# EasyEDA schematic Personal Project 2020-21.json
TITLE: Sheet_1; REV: 1.0; Date: 2021-01-09; Sheet: 1/1; Drawn By: NicolasRyj; Company: Your Company
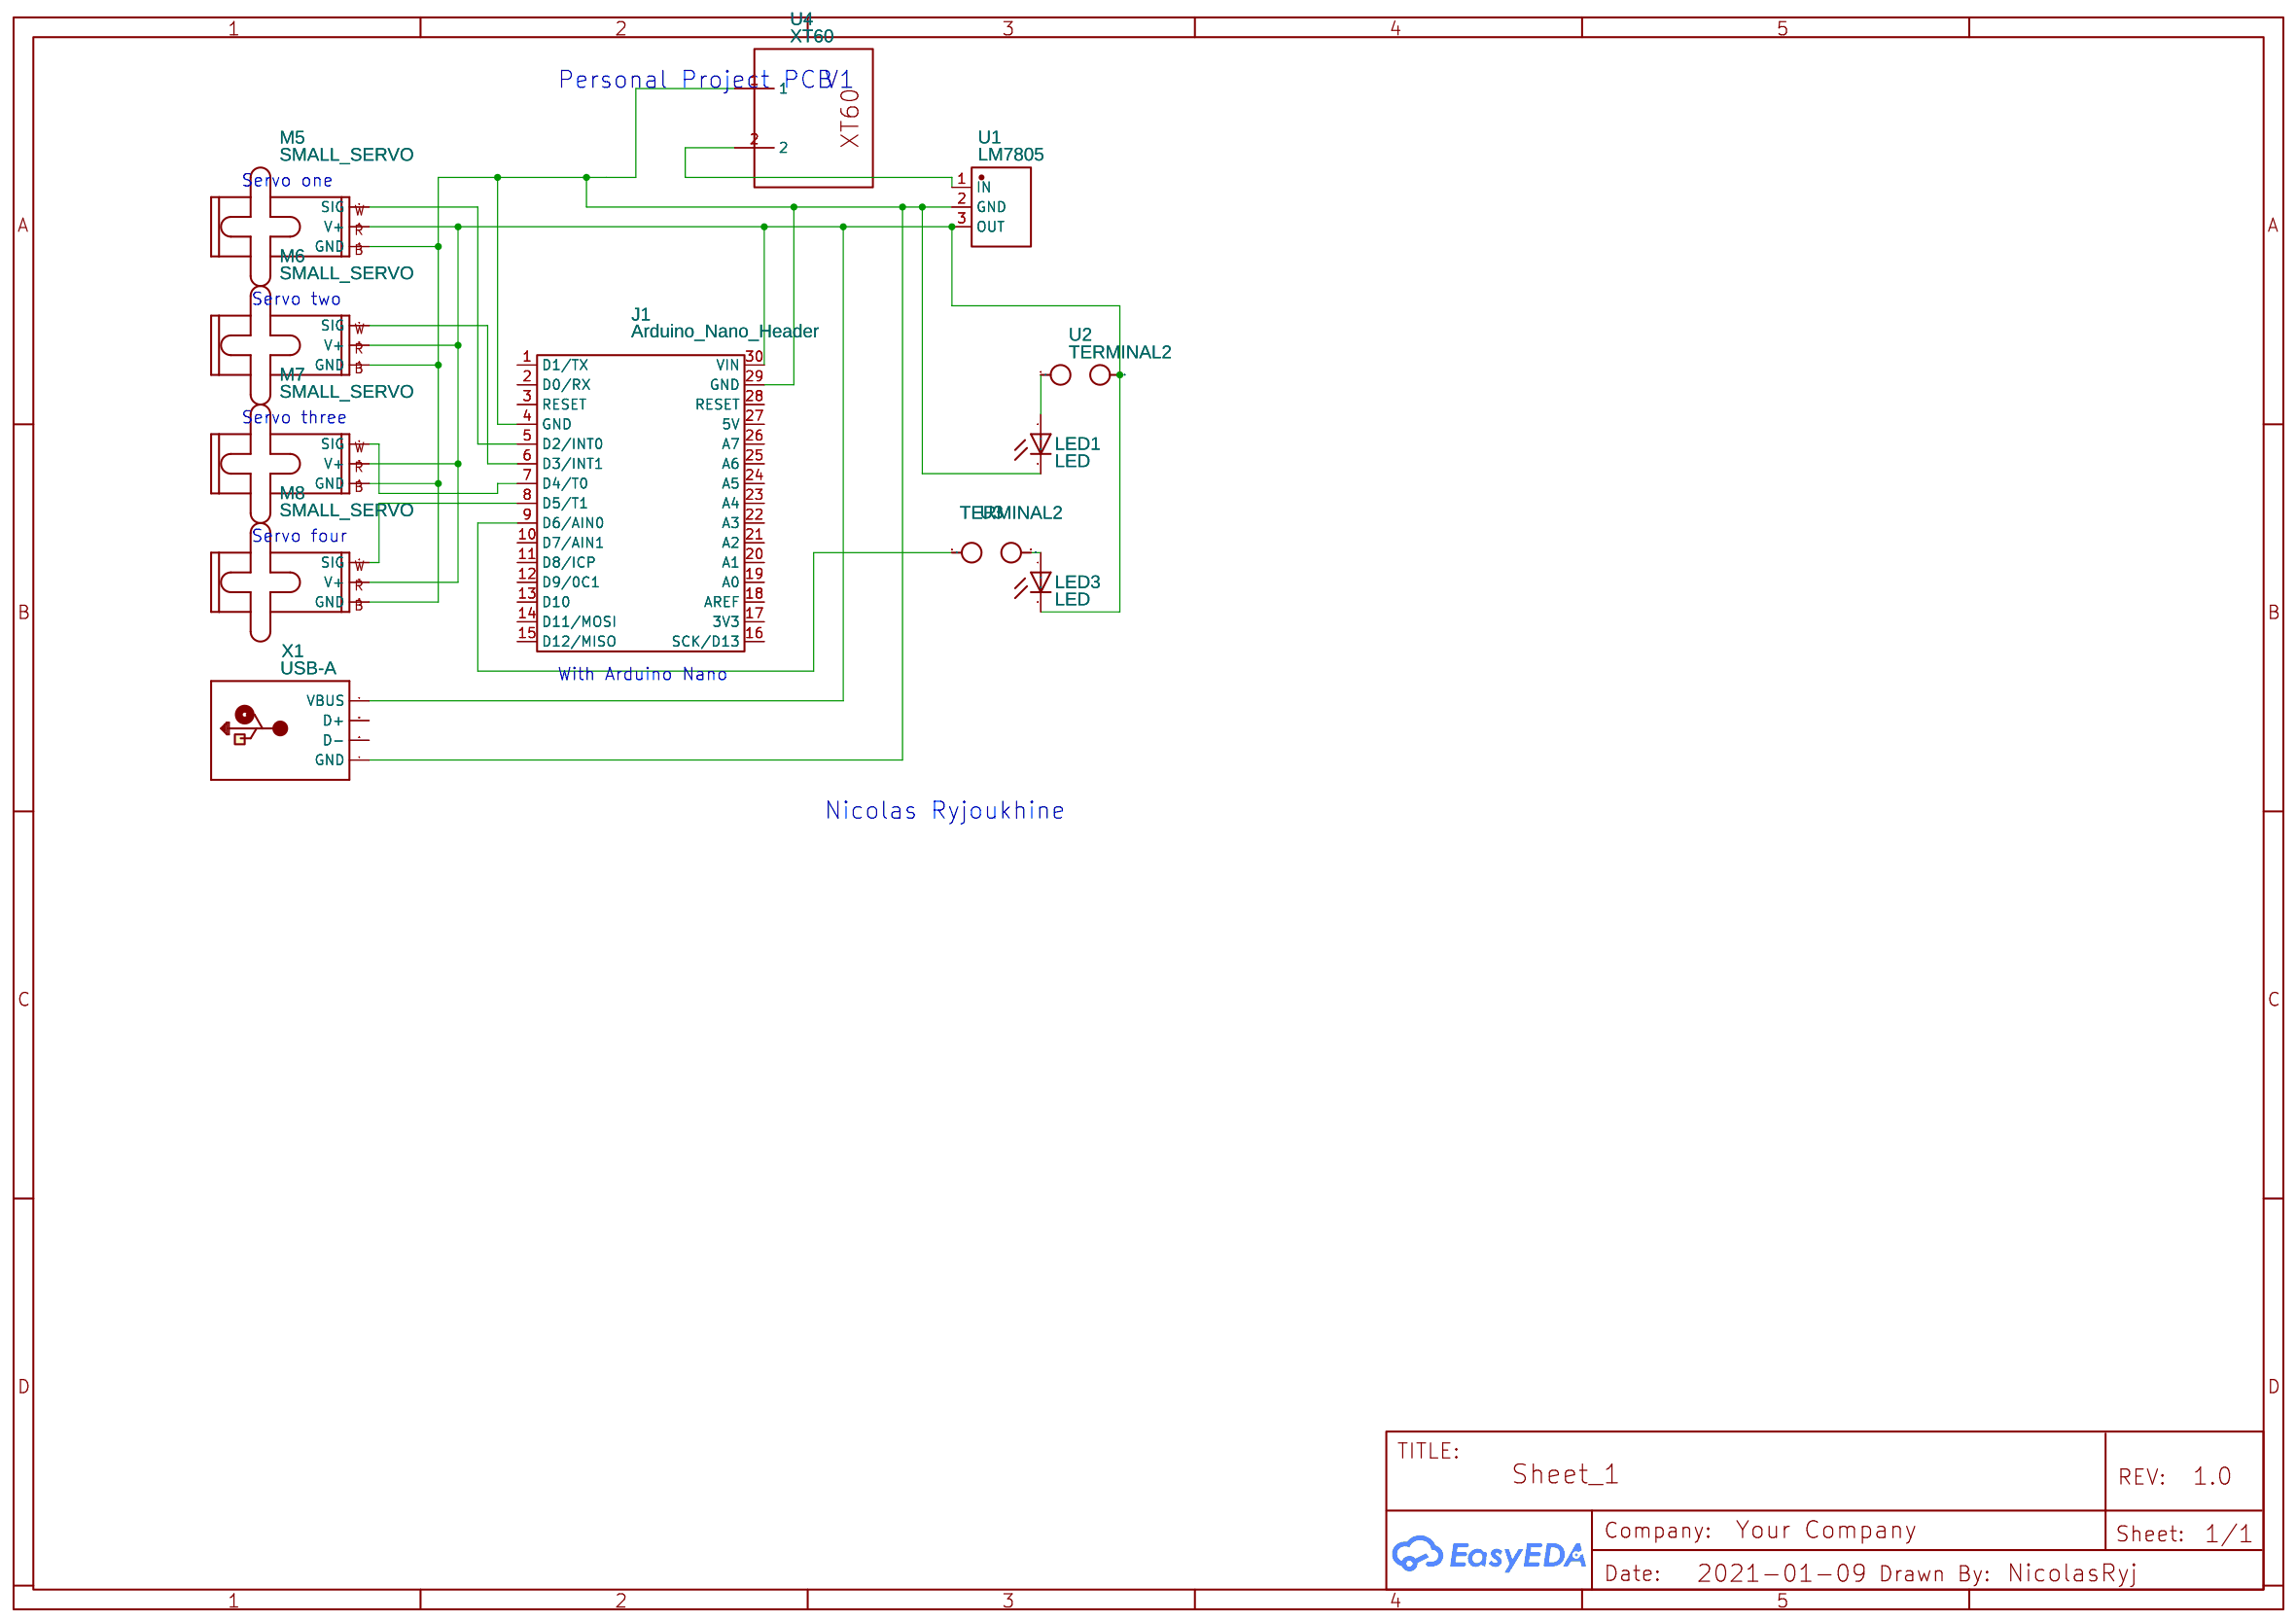
[diagram p0: schematic sheet]

## Parts
J1  Arduino_Nano_Header  [DIP-30_L43.18-W15.24-ARDUINONANO]
LED1  LED  [Q62902-B152]
LED3  LED  [Q62902-B152]
M5  SMALL_SERVO  [1X03]
M6  SMALL_SERVO  [1X03]
M7  SMALL_SERVO  [1X03]
M8  SMALL_SERVO  [1X03]
U1  LM7805  [TO-220-3_L10.0-W4.5-P2.54-L]
U2  TERMINAL2  [RESISTOR]
U3  TERMINAL2  [RESISTOR]
U4  XT60  [XT60]
X1  USB-A  [MOLEX_480371000]

## Library data of the parts
J1 = Arduino_Nano_Header
LED1 LED3 = LED: Contributor: Adafruit
M5-M8 = SMALL_SERVO: Small servo motor; Contributor: SparkFun
U1 = LM7805: Supplier: LCSC; Supplier Part: C845394; Manufacturer: TF; Contributor: LCSC; LCSC Assembly: Yes; SMT Type: Extend
U2 U3 = TERMINAL2
U4 = XT60: Contributor: Drone_H2EA
X1 = USB-A: Contributor: Adafruit

## Nets
Net-(J1-4): J1.4(GND) J1.29(GND) LED1.K(C) M5.3(GND) M6.3(GND) M7.3(GND) M8.3(GND) U1.2(GND) U4.1 X1.4(GND)
Net-(J1-5): J1.5(D2/INT0) M5.1(SIG)
Net-(J1-6): J1.6(D3/INT1) M6.1(SIG)
Net-(J1-7): J1.7(D4/T0) M7.1(SIG)
Net-(J1-8): J1.8(D5/T1) M8.1(SIG)
Net-(J1-9): J1.9(D6/AIN0) U3.1
Net-(J1-30): J1.30(VIN) LED3.K(C) M5.2(V+) M6.2(V+) M7.2(V+) M8.2(V+) U1.3(OUT) U2.2 X1.1(VBUS)
Net-(LED1-A): LED1.A U2.1
Net-(LED3-A): LED3.A U3.2
Net-(U1-1): U1.1(IN) U4.2

Not connected (* = marked no-connect by the designer): J1 1(D1/TX) 2(D0/RX) 3(RESET) 10(D7/AIN1) 11(D8/ICP) 12(D9/0C1) 13(D10) 14(D11/MOSI) 15(D12/MISO) 16(SCK/D13) 17(3V3) 18(AREF) 19(A0) 20(A1) 21(A2) 22(A3) 23(A4) 24(A5) 25(A6) 26(A7) 27(5V) 28(RESET); X1 2(D-) 3(D+)

## Notes on the sheet
- Personal Project PCB
- V1
- Servo one
- Servo two
- Servo three
- Servo four
- With Arduino Nano
- Nicolas Ryjoukhine
